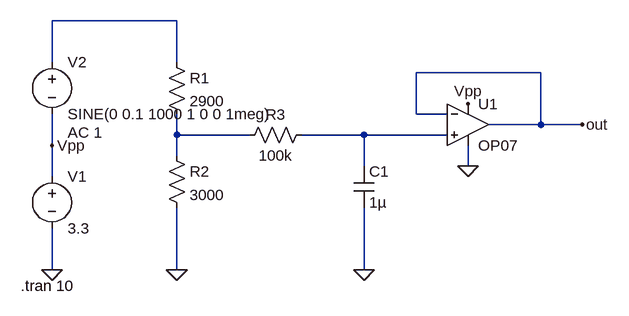
[diagram p0: schematic Sim_MioCond.asc]
Sim_MioCond.asc, the LTspice schematic file:
Version 4
SHEET 1 880 680
WIRE 112 0 -80 0
WIRE -80 64 -80 0
WIRE 112 64 112 0
WIRE 672 80 480 80
WIRE 480 144 480 80
WIRE 528 144 480 144
WIRE 672 160 672 80
WIRE 672 160 592 160
WIRE 736 160 672 160
WIRE 112 176 112 144
WIRE 224 176 112 176
WIRE 400 176 304 176
WIRE 528 176 400 176
WIRE -80 192 -80 144
WIRE 112 208 112 176
WIRE 400 224 400 176
WIRE 560 224 560 192
WIRE -80 240 -80 192
WIRE -80 384 -80 320
WIRE 112 384 112 288
WIRE 400 384 400 288
FLAG -80 384 0
FLAG 112 384 0
FLAG 400 384 0
FLAG 560 224 0
FLAG 560 128 Vpp
FLAG 736 160 out
FLAG -80 192 Vpp
SYMBOL res 96 48 R0
SYMATTR InstName R1
SYMATTR Value 2900
SYMBOL res 96 192 R0
SYMATTR InstName R2
SYMATTR Value 3000
SYMBOL res 320 160 R90
WINDOW 0 0 56 VBottom 2
WINDOW 3 32 56 VTop 2
SYMATTR InstName R3
SYMATTR Value 100k
SYMBOL cap 384 224 R0
SYMATTR InstName C1
SYMATTR Value 1µ
SYMBOL voltage -80 224 R0
WINDOW 123 0 0 Left 0
WINDOW 39 0 0 Left 0
SYMATTR InstName V1
SYMATTR Value 3.3
SYMBOL OpAmps\\OP07 560 96 R0
SYMATTR InstName U1
SYMBOL voltage -80 48 R0
WINDOW 123 24 124 Left 2
WINDOW 39 0 0 Left 0
SYMATTR Value2 AC 1
SYMATTR InstName V2
SYMATTR Value SINE(0 0.1 1000 1 0 0 1meg)
TEXT -128 408 Left 2 !.tran 10

The netlist it stands for:
* Sim_MioCond.asc
R1 N001 N002 2900
R2 N002 0 3000
R3 N003 N002 100k
C1 N003 0 1µ
V1 Vpp 0 3.3
XU1 N003 out Vpp 0 out LT1001  ; OP07, pins In+ In- V+ V- OUT
V2 N001 Vpp SINE(0 0.1 1000 1 0 0 1meg) AC 1
.tran 10
.lib LTC.lib
.backanno
.end